# Altium schematic sheet [11]_MOT_tCONTROL LED STATUS.SchDoc
size A3; DocumentNumber: 11; SheetNumber: 11; SheetTotal: 12
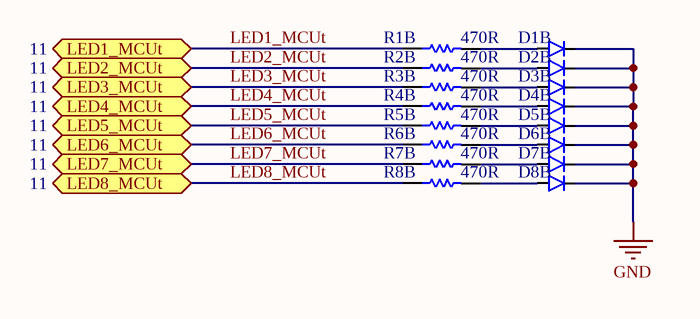
[diagram p0: [11]_MOT_tCONTROL LED STATUS.SchDoc]

## Parts
D1B  LED 0603  [LED0603]  (value not drawn)
D2B  LED 0603  [LED0603]  (value not drawn)
D3B  LED 0603  [LED0603]  (value not drawn)
D4B  LED 0603  [LED0603]  (value not drawn)
D5B  LED 0603  [LED0603]  (value not drawn)
D6B  LED 0603  [LED0603]  (value not drawn)
D7B  LED 0603  [LED0603]  (value not drawn)
D8B  LED 0603  [LED0603]  (value not drawn)
R1B  470R  [res 0603]
R2B  470R  [res 0603]
R3B  470R  [res 0603]
R4B  470R  [res 0603]
R5B  470R  [res 0603]
R6B  470R  [res 0603]
R7B  470R  [res 0603]
R8B  470R  [res 0603]

## Ports
LED1_MCUt (bidir, see 11), LED2_MCUt (bidir, see 11), LED3_MCUt (bidir, see 11), LED4_MCUt (bidir, see 11), LED5_MCUt (bidir, see 11), LED6_MCUt (bidir, see 11), LED7_MCUt (bidir, see 11), LED8_MCUt (bidir, see 11)

## Nets
GND: D1B.1(K) D2B.1(K) D3B.1(K) D4B.1(K) D5B.1(K) D6B.1(K) D7B.1(K) D8B.1(K)
LED1_MCUt: R1B.1 ; port LED1_MCUt
LED2_MCUt: R2B.1 ; port LED2_MCUt
LED3_MCUt: R3B.1 ; port LED3_MCUt
LED4_MCUt: R4B.1 ; port LED4_MCUt
LED5_MCUt: R5B.1 ; port LED5_MCUt
LED6_MCUt: R6B.1 ; port LED6_MCUt
LED7_MCUt: R7B.1 ; port LED7_MCUt
LED8_MCUt: R8B.1 ; port LED8_MCUt
NetD1B_2: D1B.2(A) R1B.2
NetD2B_2: D2B.2(A) R2B.2
NetD3B_2: D3B.2(A) R3B.2
NetD4B_2: D4B.2(A) R4B.2
NetD5B_2: D5B.2(A) R5B.2
NetD6B_2: D6B.2(A) R6B.2
NetD7B_2: D7B.2(A) R7B.2
NetD8B_2: D8B.2(A) R8B.2

## Library data of the parts
R1B R2B R3B R4B R5B R6B R7B R8B = Res0.3: RES SMD, 470 OHM 5% 1/8W 0603; MANUFACTURER1: KOA Speer Electronics, Inc.; MANUFACTURER1_PART#: RK73B1JTTD471J; MANUFACTURER2_PART#: RMCF0603JT470R; PACKING: Tape & Reel (TR); PCB Footprint: 0603; Process Type: SM; Unit: PCS; Power: 0.25W; Value: 470R; CATEGORY: RES SMD; MANUFACTURER2: Stackpole; Tolerance: ±5%